# Altium schematic sheet 0216_DG2 TITLE PAGE.SchDoc
size 848 x 558 mm
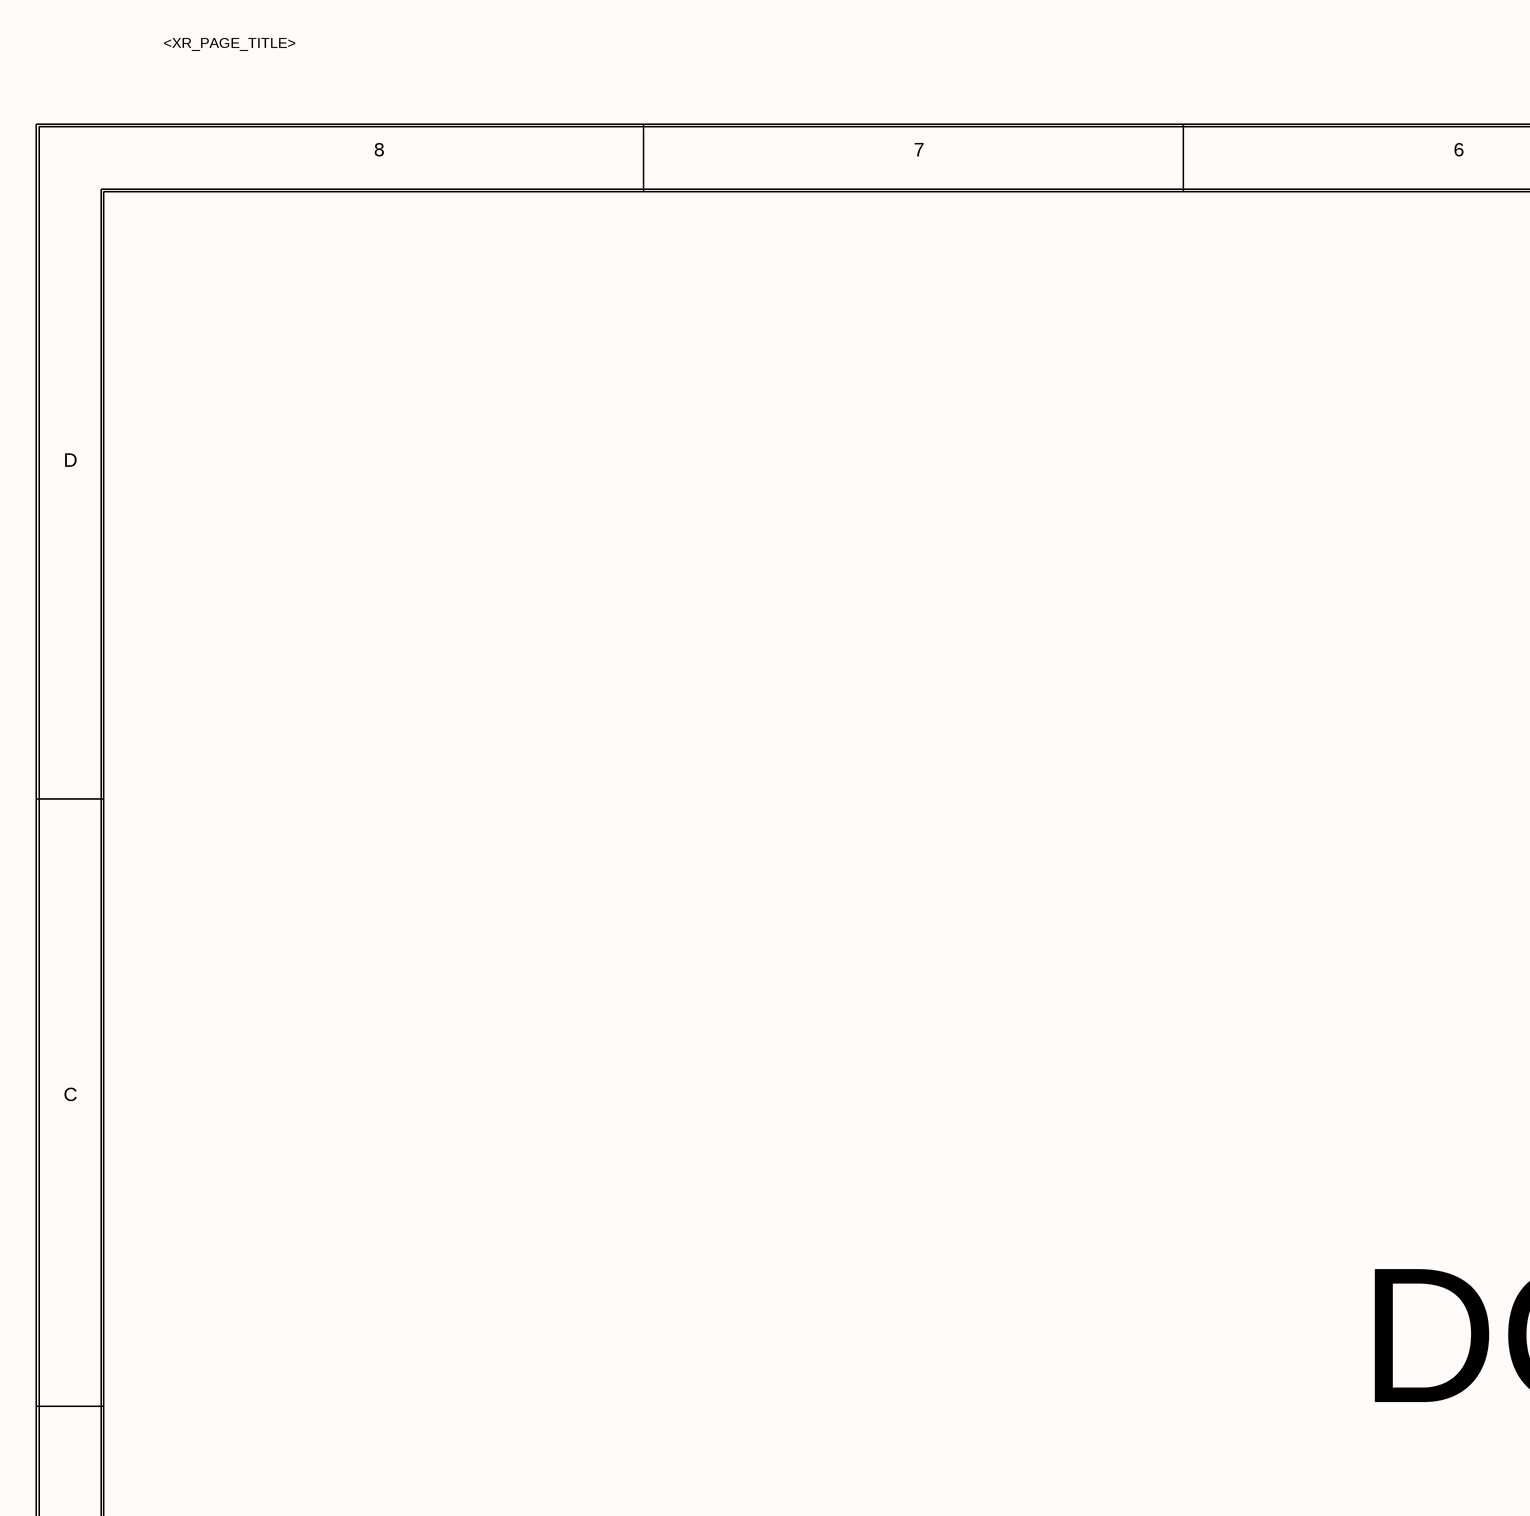
[diagram p0: 0216_DG2 TITLE PAGE.SchDoc, top left]
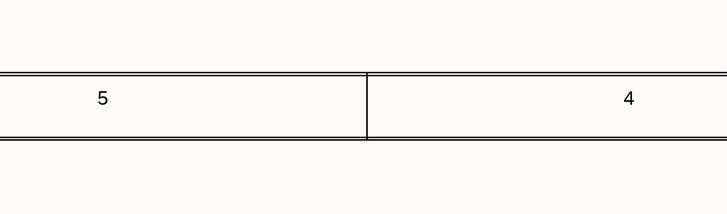
[diagram p1: 0216_DG2 TITLE PAGE.SchDoc, top middle]
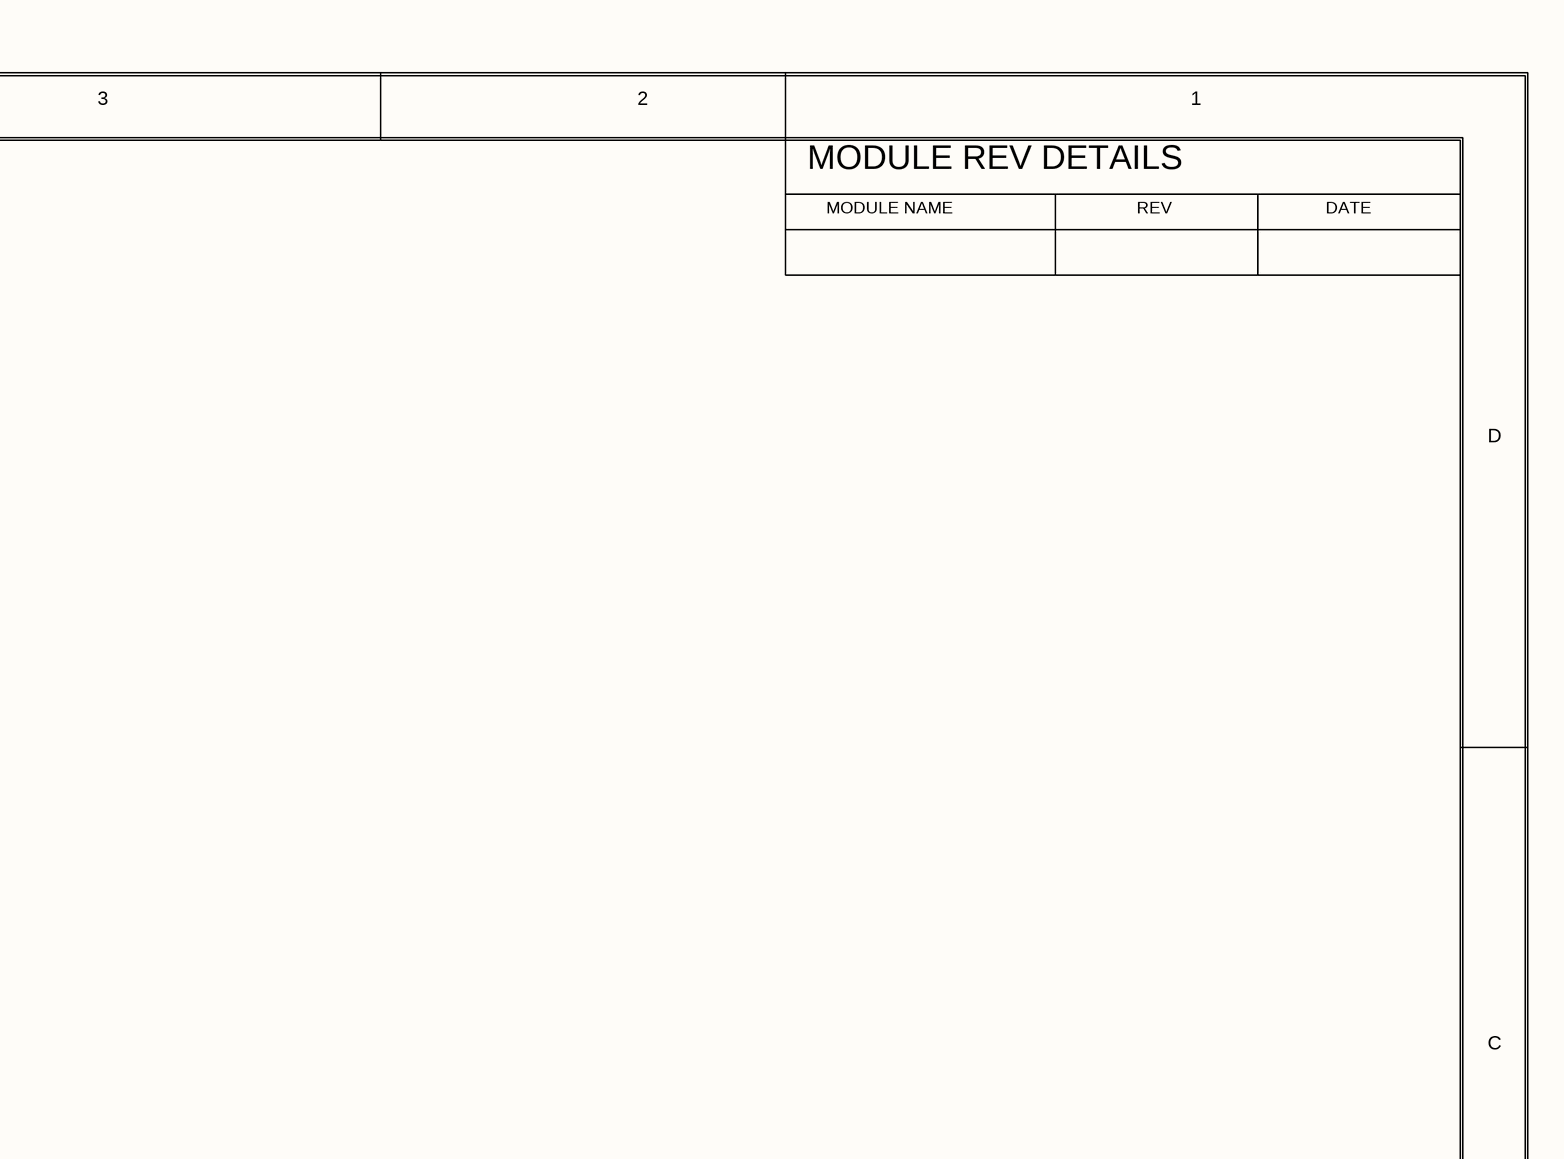
[diagram p2: 0216_DG2 TITLE PAGE.SchDoc, top right]
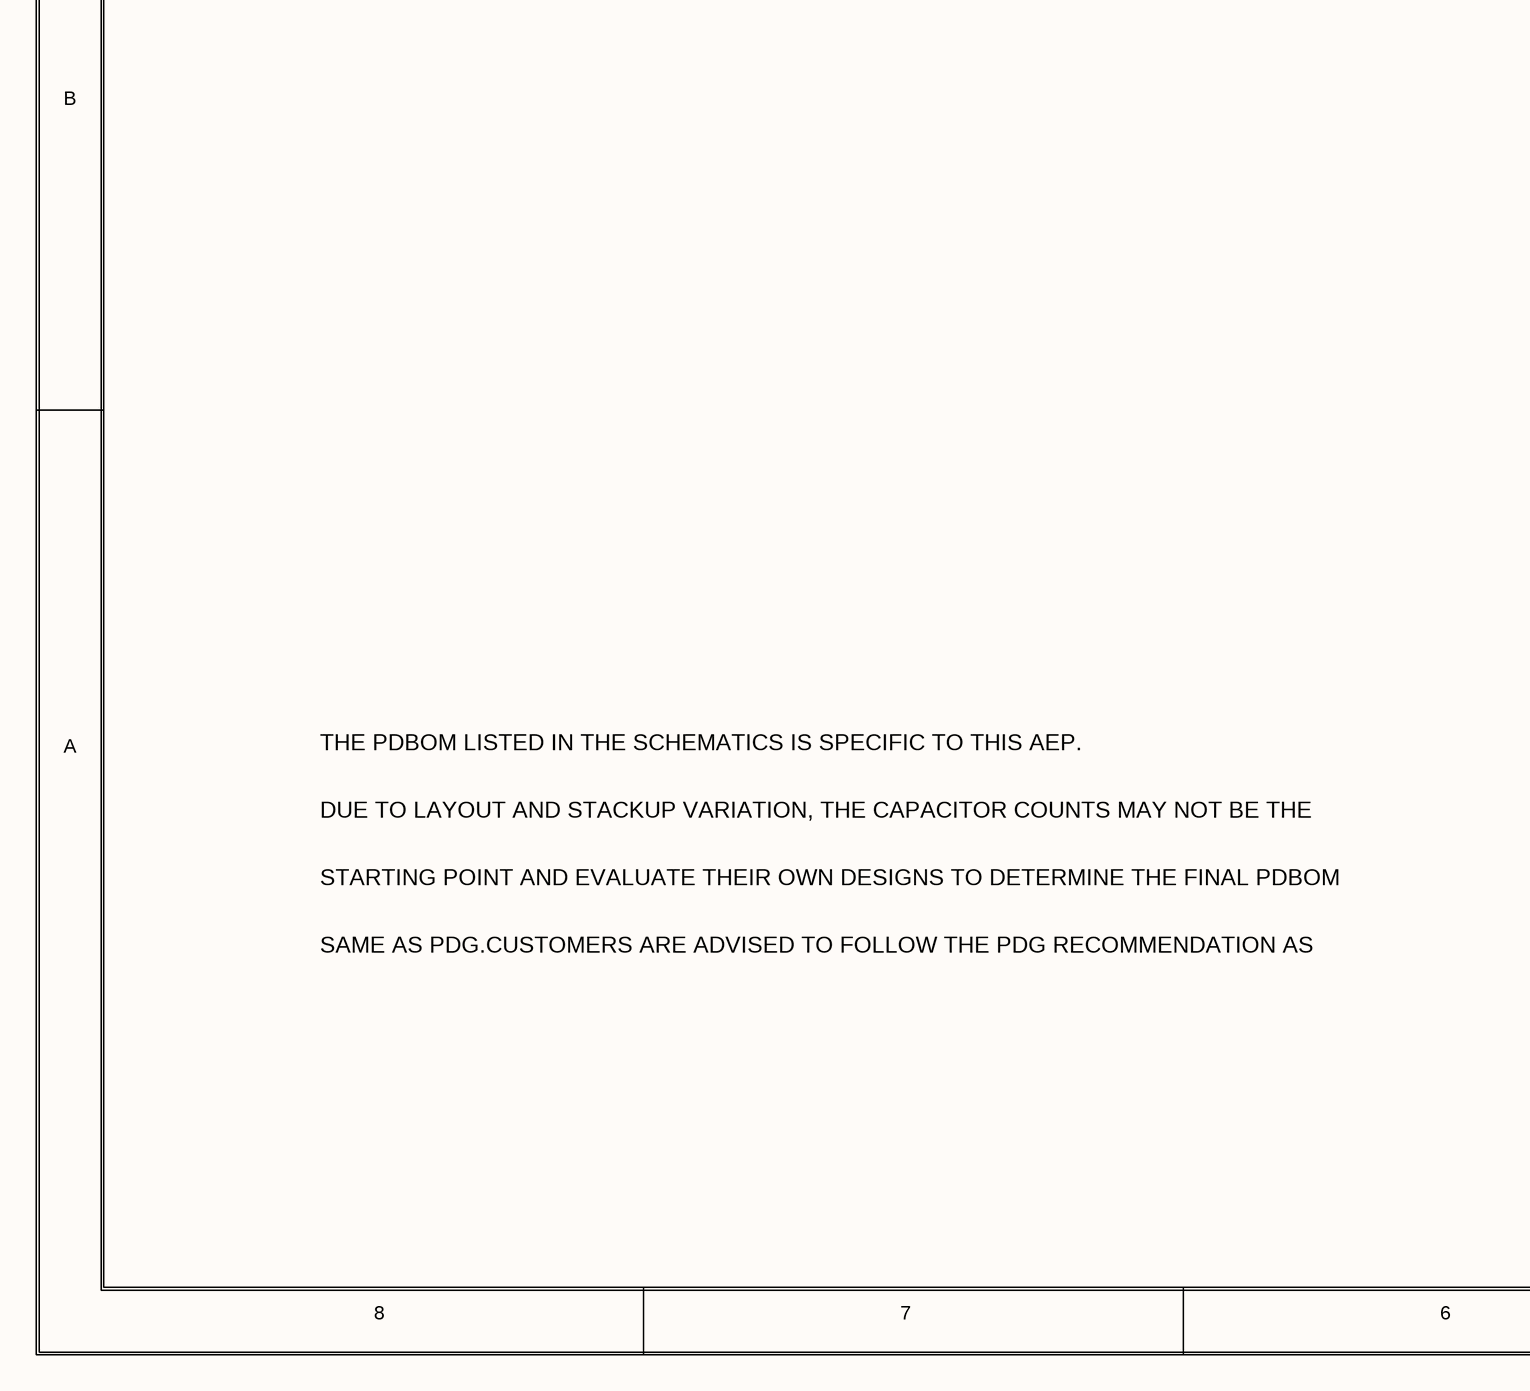
[diagram p3: 0216_DG2 TITLE PAGE.SchDoc, bottom left]
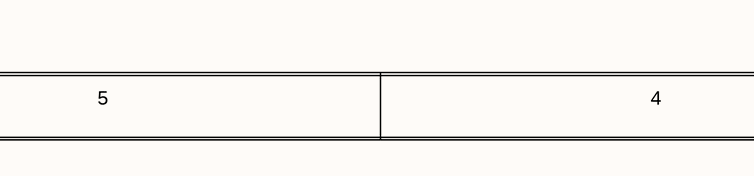
[diagram p4: 0216_DG2 TITLE PAGE.SchDoc, bottom middle]
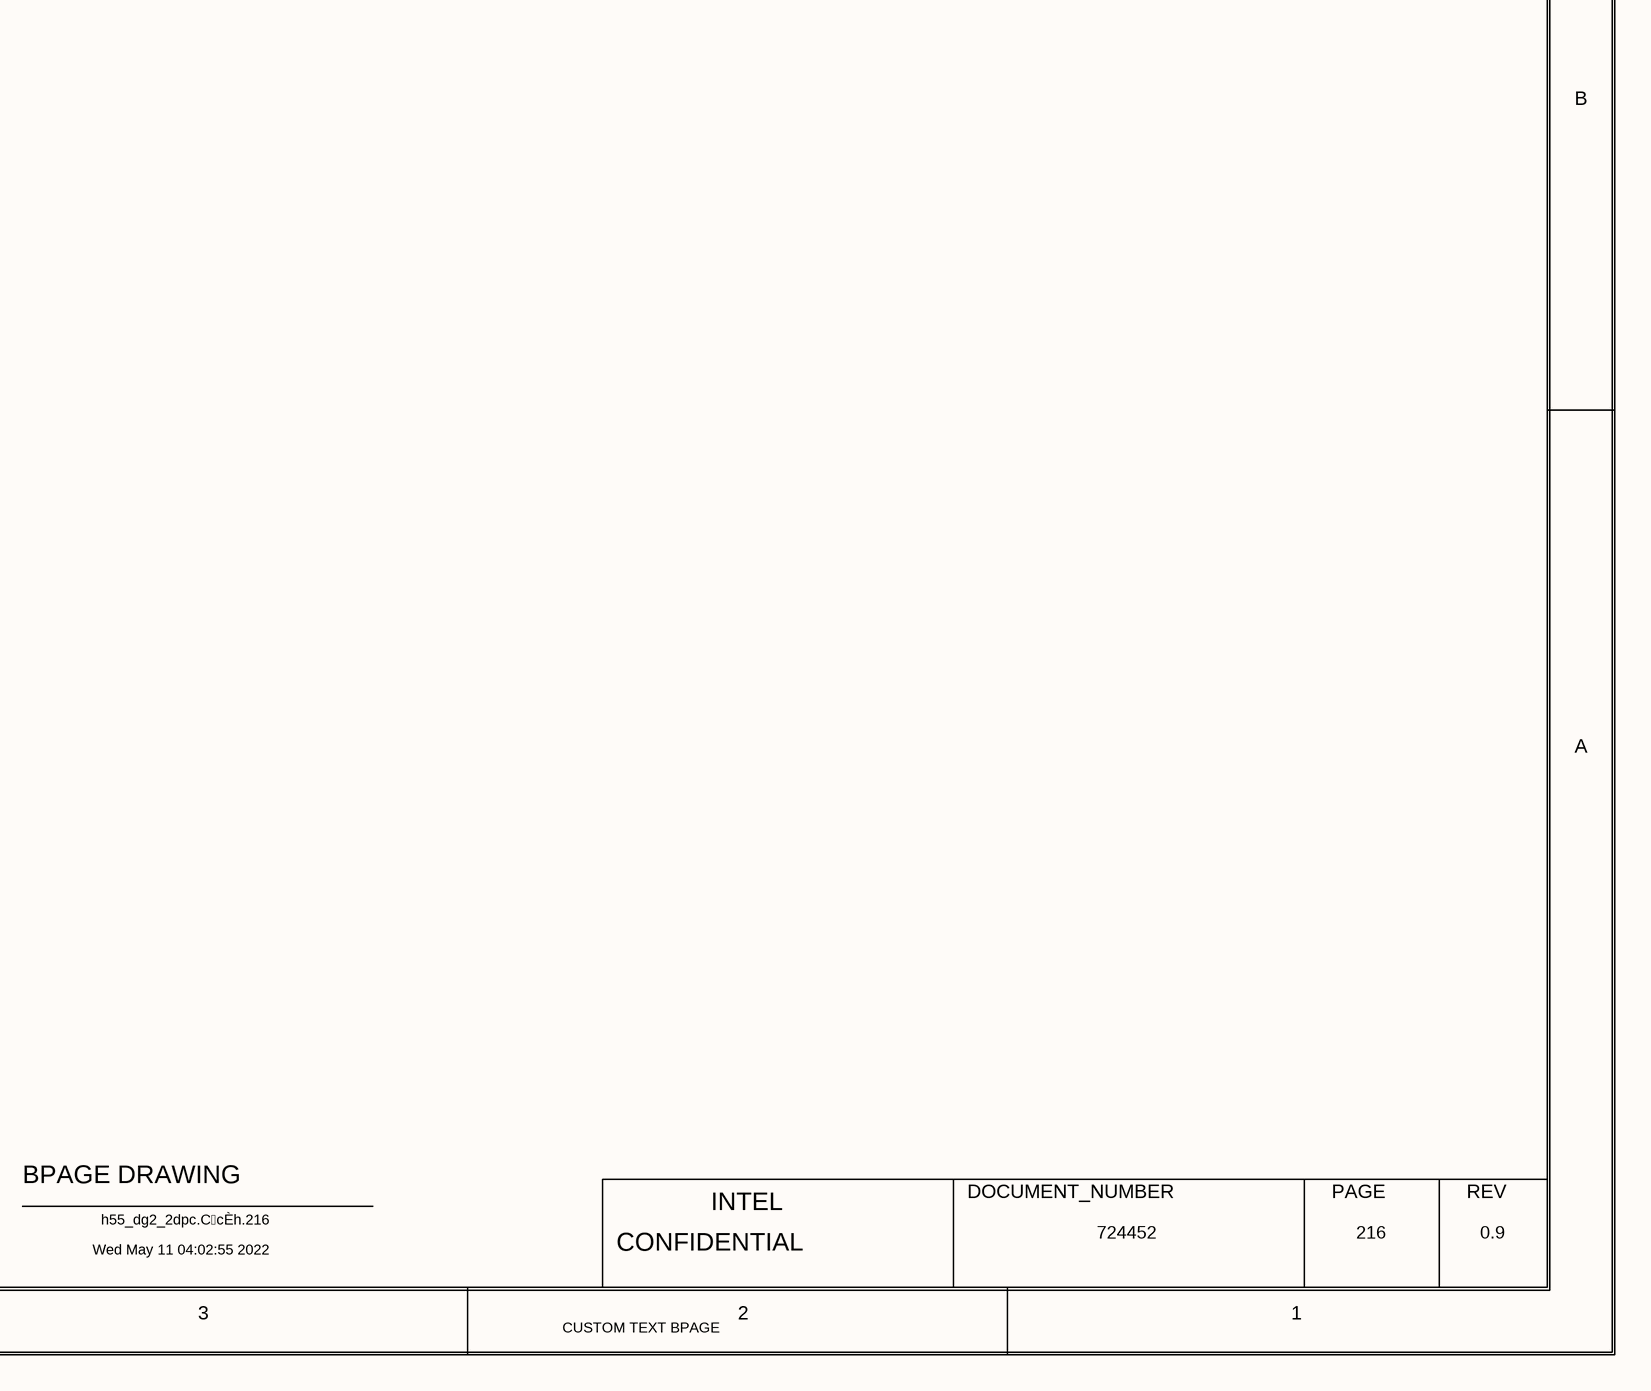
[diagram p5: 0216_DG2 TITLE PAGE.SchDoc, bottom right]

## Notes on the sheet
- <XR_PAGE_TITLE>
- 8
- 7
- 6
- 5
- 4
- 3
- 2
- 1
- MODULE REV DETAILS
- MODULE NAME
- REV
- DATE
- D
- C
- DG2-512EU
- B
- A
- THE PDBOM LISTED IN THE SCHEMATICS IS SPECIFIC TO THIS AEP.
- DUE TO LAYOUT AND STACKUP VARIATION, THE CAPACITOR COUNTS MAY NOT BE THE
- STARTING POINT AND EVALUATE THEIR OWN DESIGNS TO DETERMINE THE FINAL PDBOM
- SAME AS PDG.CUSTOMERS ARE ADVISED TO FOLLOW THE PDG RECOMMENDATION AS
- BPAGE DRAWING
- INTEL
- DOCUMENT_NUMBER
- PAGE
- Wed May 11 04:02:55 2022
- h55_dg2_2dpc.CcÈh.216
- CONFIDENTIAL
- 724452
- 216
- 0.9
- CUSTOM TEXT BPAGE